# Altium schematic sheet SPE_router.SchDoc: SPE Router
size 420 x 297 mm; Author: P. Daniel; CompanyName: WUT ISE; DrawnBy: P. Daniel; Organization: WUT ISE; Address1: WUT ISE; Address2: Nowowiejska 15/19 00-665 Warsaw; Address3: piotrmaciejdaniel@gmail.com; Revision: 1; SheetNumber: 1; SheetTotal: 1; ModifiedBy: -; CreateDate: 02-03.2023; CheckedDate: -; Title2: top schematic; DivGrp: WUT ISE; Designer: Piotr Daniel
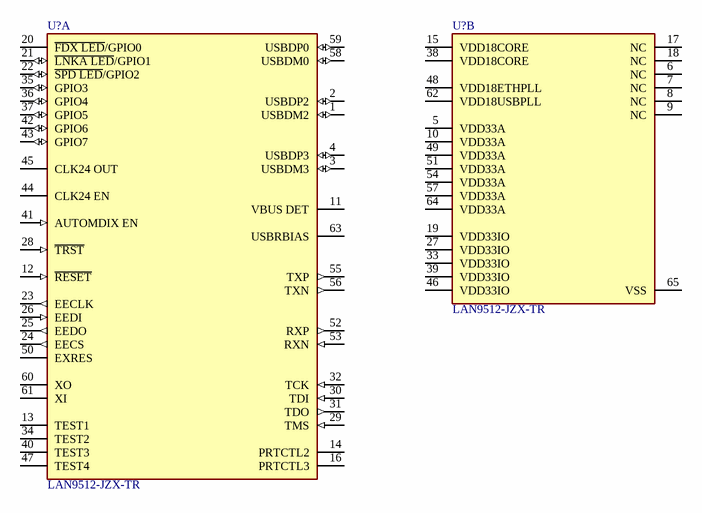
[diagram p0: SPE_router.SchDoc]

## Parts
(Parts that share a designator on the sheet are numbered #1, #2 ... from top to bottom, then left to right.)
U?#1  LAN9512-JZX-TR  [FP-LAN9512-JZX-TR-IPC_B]  (part A of 2)
U?#2  LAN9512-JZX-TR  [FP-LAN9512-JZX-TR-IPC_B]  (part B of 2)

## Nets

Not connected (* = marked no-connect by the designer): U?#1 1(USBDM2) 2(USBDP2) 3(USBDM3) 4(USBDP3) 11(VBUS_DET) 12(~{RESET}) 13(TEST1) 14(PRTCTL2) 16(PRTCTL3) 20(~{FDX_LED}/GPIO0) 21(~{LNKA_LED}/GPIO1) 22(~{SPD_LED}/GPIO2) 23(EECLK) 24(EECS) 25(EEDO) 26(EEDI) 28(~{TRST}) 29(TMS) 30(TDI) 31(TDO) 32(TCK) 34(TEST2) 35(GPIO3) 36(GPIO4) 37(GPIO5) 40(TEST3) 41(AUTOMDIX_EN) 42(GPIO6) 43(GPIO7) 44(CLK24_EN) 45(CLK24_OUT) 47(TEST4) 50(EXRES) 52(RXP) 53(RXN) 55(TXP) 56(TXN) 58(USBDM0) 59(USBDP0) 60(XO) 61(XI) 63(USBRBIAS); U?#2 5(VDD33A) 6(NC) 7(NC) 8(NC) 9(NC) 10(VDD33A) 15(VDD18CORE) 17(NC) 18(NC) 19(VDD33IO) 27(VDD33IO) 33(VDD33IO) 38(VDD18CORE) 39(VDD33IO) 46(VDD33IO) 48(VDD18ETHPLL) 49(VDD33A) 51(VDD33A) 54(VDD33A) 57(VDD33A) 62(VDD18USBPLL) 64(VDD33A) 65(VSS)

## Notes on the sheet
- Project/Equipment
- Document
- Designer
- Drawn by
- Check.by
- Copyright WUT ISE 2021.
  This documentation describes Open Hardware and is licensed under the CERN OHL v.1.1. You may redistribute and modify this documentation under the terms of the CERN OHL v.1.1. (http://ohwr.org/CERNOHL). This documentation is distributed WITHOUT ANY EXPRESS OR IMPLIED WARRANTY, INCLUDING OF MERCHANTABILITY, SATISFACTORY QUALITY AND FITNESS FOR A PARTICULAR PURPOSE. Please see the CERN OHL v.1.1 for applicable conditions.
- Contact
- File
- Last Mod.
- Print Date
- Sheet
- Size
- A3
- of
- Rev

## Library data of the parts
U?#1 U?#2 = CMP-06298-000016-1: IC USB 2.0 ETHER CTRLR 64QFN; Operating Supply Current: 231mA; Number of Ports: 2; Max Power Dissipation: 763mW; Operating Supply Voltage: 3.3V; Data Rate: 480Mbps; Package Quantity: 3000; Interface: USB; Number of Pins: 64; Max Operating Temperature: 70°C; Packaging: Tape and Reel; RoHS Compliant: Yes; Min Operating Temperature: 0°C; Case/Package: QFN; Mount: Surface Mount; Radiation Hardening: No